# EAGLE design LTC3114 (EAGLE 6.3)
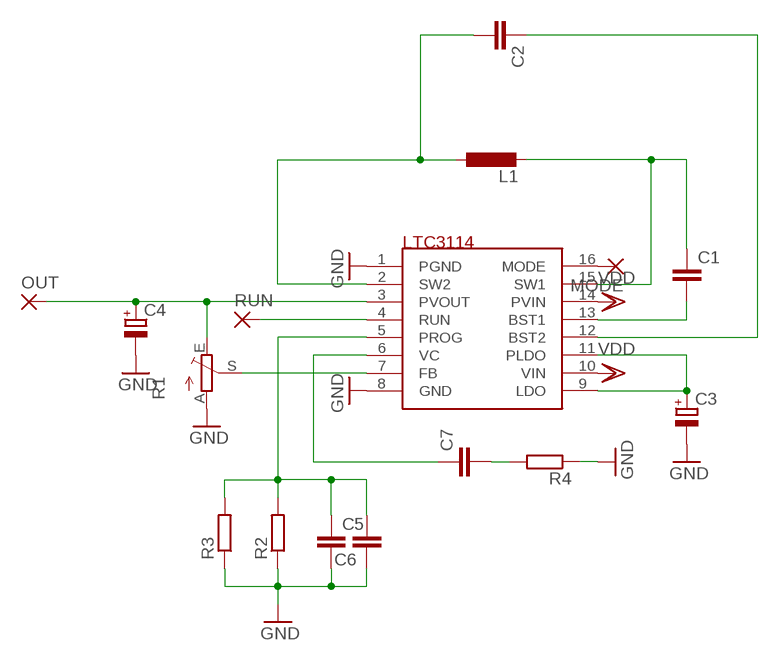
[diagram p0: schematic, sheet 1]

## Parts
C1  C-EUC0805  [C0805]
C2  C-EUC0805  [C0805]
C3  CPOL-EUE2,5-6E  [E2,5-6E]
C4  CPOL-EUE2,5-6E  [E2,5-6E]
C5  C-EUC0805  [C0805]
C6  C-EU025-025X050  [C025-025X050]
C7  C-EUC0805  [C0805]
L1  L-EUL3225M  [L3225M]
MODE  1,6/0,8  [1,6/0,8]
OUT  1,6/0,8  [1,6/0,8]
R1  TRIM_EU-RJ9W  [RJ9W]
R2  R-EU_M0805  [M0805]
R3  R-EU_0204/7  [0204/7]
R4  R-EU_M0805  [M0805]
RUN  1,6/0,8  [1,6/0,8]
U$1  LTC3114  [TSSOP16]

## Nets
GND: C3.- C4.- C5.2 C6.1 R1.A R2.1 R3.1 R4.1 U$1.1(PGND) U$1.8(GND)
N$1: C1.2 U$1.13(BST1)
N$2: C1.1 L1.2 U$1.15(SW1)
N$3: C2.1 U$1.12(BST2)
N$4: C2.2 L1.1 U$1.2(SW2)
N$5: C3.+ U$1.9(LDO) U$1.11(PLDO)
N$6: R1.S U$1.7(FB)
N$7: C4.+ OUT.1(P) R1.E U$1.3(PVOUT)
N$8: RUN.1(P) U$1.4(RUN)
N$9: C5.1 C6.2 R2.2 R3.2 U$1.5(PROG)
N$10: MODE.1(P) U$1.16(MODE)
N$13: C7.2 R4.2
N$14: C7.1 U$1.6(VC)
VDD: U$1.10(VIN) U$1.14(PVIN)

## Library data of the parts
C1 C2 C6 = resistor:C-EU: CAPACITOR, European symbol
C3 C4 = rcl:CPOL-EU: POLARIZED CAPACITOR, European symbol
C5 C7 = rcl:C-EU: CAPACITOR, European symbol
L1 = rcl:L-EU: INDUCTOR, European symbol
MODE OUT RUN = wirepad:1,6/0,8: THROUGH-HOLE PAD
R1 = pot:TRIM_EU-: POTENTIOMETER
R2-R4 = rcl:R-EU_: RESISTOR, European symbol
U$1 = ref-packages:LTC3114

## Net classes
0 default: clearance 0.7 mm

## Board
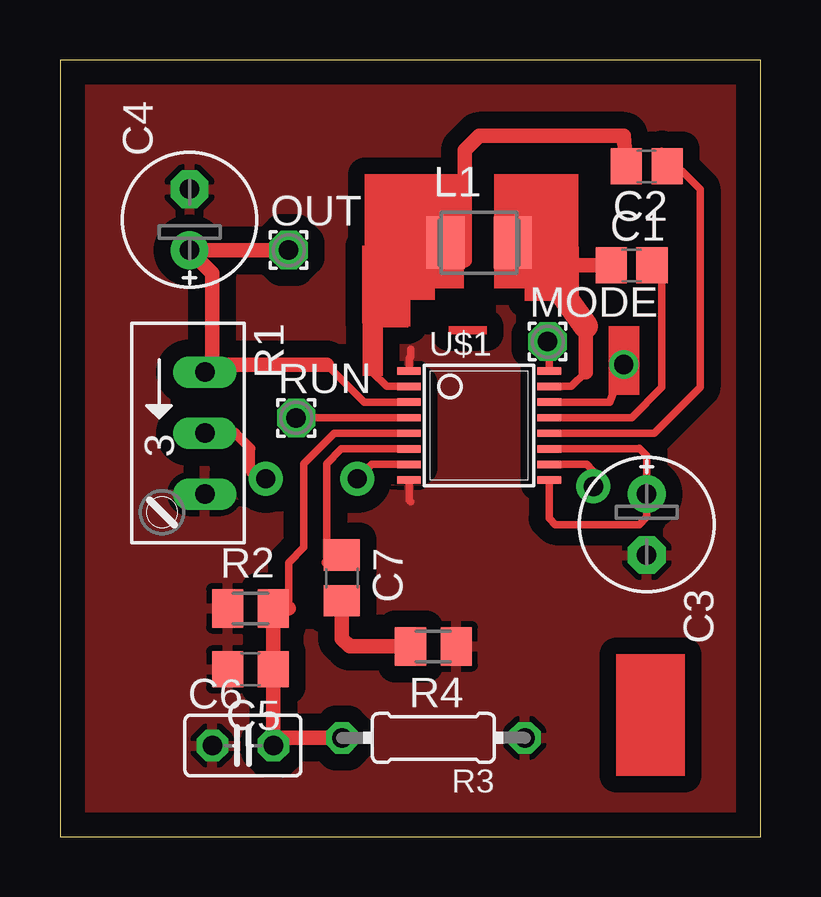
[diagram p1: board, top side]
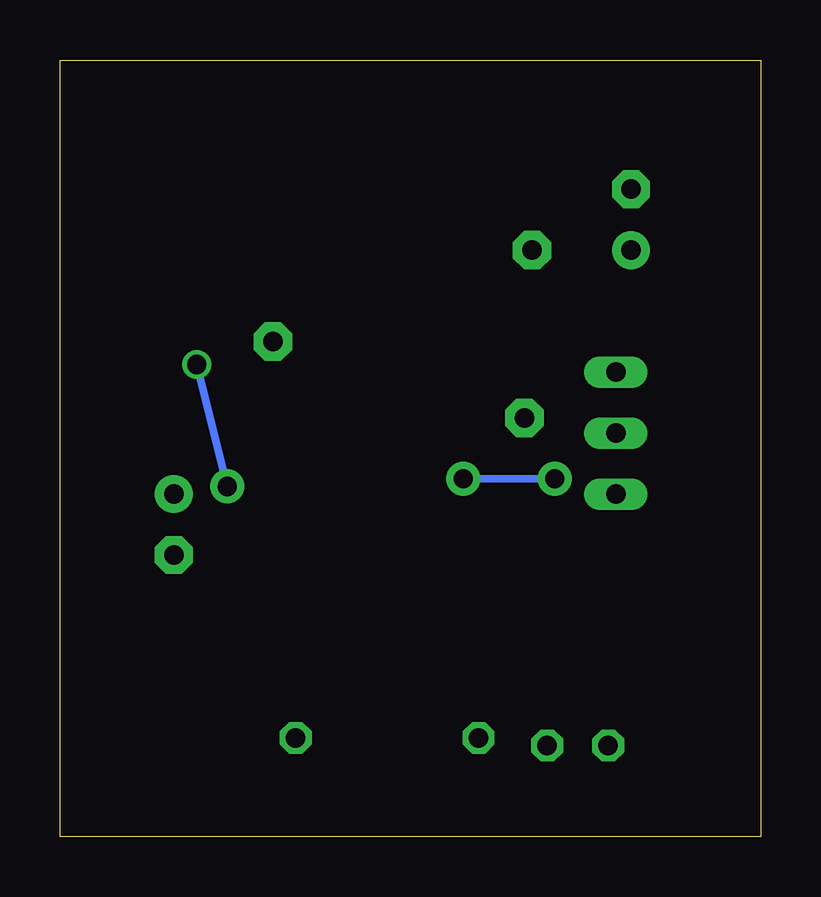
[diagram p2: board, bottom side, seen from below]

Size 29.19 x 32.37 mm. Coordinates in mm from the lower left corner, seen from the top.
Outline: 0,0 29.19,0 29.19,32.37 0,32.37 0,0
Copper layers (1*16): Top 0.035mm / dielectric 1.5mm / Bottom 0.035mm
Design rules "default": minimum track width 10mil, minimum drill 24mil, track to track 8mil, track to pad 8mil, pad to pad 8mil, via to via 8mil, smd to smd 8mil, copper to edge 40mil, drill to drill 8mil, minimum pad ring 10mil, minimum via ring 8mil, stop-mask expansion 4mil, vias tented up to drill 0mil, thermal gap 10mil

### Footprints (pad centres in the part's own frame; a part is rotated, then mirrored left to right if it is on the bottom)
C0805 = smd 1.3 x 1.5: 1 -0.85,0; 2 0.85,0
E2,5-6E = drill 0.813 pad 1.575: + -1.27,0 | drill 0.813 pad 1.575 octagon: - 1.27,0
C0805' = smd 1.3 x 1.5: 1 -0.95,0; 2 0.95,0
C025-025X050 = drill 0.813 octagon: 1 -1.27,0; 2 1.27,0
L3225M = smd 1.6 x 2.2: 1 -1.4,0; 2 1.4,0
1,6/0,8 = drill 0.813 pad 1.6 octagon: 1 0,0
RJ9W = drill 0.813 long: A 2.54,0.635; E -2.54,0.635; S 0,0.635
M0805 = smd 1.3 x 1.6: 1 -0.95,0; 2 0.95,0
0204/7 = drill 0.813 octagon: 1 -3.81,0; 2 3.81,0
TSSOP16 = smd 0.305 x 0.991: 1 -2.275,-2.918; 2 -1.625,-2.918; 3 -0.975,-2.918; 4 -0.325,-2.918; 5 0.325,-2.918; 6 0.975,-2.918; 7 1.625,-2.918; 8 2.275,-2.918; 9 2.275,2.918; 10 1.625,2.918; 11 0.975,2.918; 12 0.325,2.918; 13 -0.325,2.918; 14 -0.975,2.918; 15 -1.625,2.918; 16 -2.275,2.918

### Placement (x,y rotation side)
C1  23.81,23.81 0 top
C2  24.45,27.94 180 top
C3  24.45,13.02 270 top
C4  5.4,25.72 90 top
C5  [C0805']  7.94,6.99 180 top
C6  7.62,3.81 0 top
C7  [C0805']  11.75,10.79 270 top
L1  17.46,24.77 0 top
MODE  20.32,20.64 0 top
OUT  9.53,24.45 0 top
R1  5.4,16.83 270 top
R2  7.94,9.53 0 top
R3  15.56,4.13 180 top
R4  15.56,7.94 180 top
RUN  9.84,17.46 0 top
U$1  17.46,17.15 270 top

### Tracks (layer width: path | path; a pad name or v marks a point on that pad's centre or on a via)
GND
  Top 0.305: U$1.1 14.54,19.94 14.6,20 14.6,20.32 | U$1.8 14.54,14.03 14.6,13.97
  pour Top: -5.4,-8.25 41.59,-8.25 41.59,36.2 -5.4,36.2
N$1
  Top 0.305: U$1.13 23.82,17.47 25.08,18.73 25.08,23.39 C1.2
N$2
  Top 0.305: U$1.15 21.31,18.77 21.91,19.37 | 20.32,23.5 20,23.5 | 20,23.5 L1.2 | 20.32,23.81 20,23.5
  Top 0.61: 21.91,19.37 21.91,21.27 | C1.1 20.32,23.81
  Top 1.016: 21.91,21.27 20.32,23.5
N$3
  Top 0.305: C2.1 25.08,28.58 26.67,26.99 26.67,18.73 24.76,16.83 U$1.12
N$4
  Top 0.305: U$1.2 13.62,18.77 13.02,19.37 13.02,21.27 15.24,23.5 L1.1 16.86,24.02
  Top 0.61: C2.2 23.5,29.21 17.46,29.21 16.86,28.61 16.86,24.02
N$5
  Top 0.305: 24.15,16.17 U$1.11 24.11,16.17 24.13,16.19 24.15,16.17 | 24.15,16.17 24.45,15.88 C3.+ 24.45,13.33 24.13,13.02 20.64,13.02 20.38,13.28 U$1.9
N$6  (via drill 0.8 pad 1.42)
  Top 0.305: U$1.7 12.98,15.52 v12.38,14.92
  Top 0.406: v8.57,14.92 8.26,14.92 7.94,15.24 7.94,16.19 7.3,16.83 R1.S
  Bottom 0.305: v12.38,14.92 v8.57,14.92
N$7
  Top 0.305: U$1.3 12.68,18.12 11.11,19.69
  Top 0.61: 11.11,19.69 6.35,19.69 | 6.35,19.69 R1.E | 6.35,19.69 6.35,23.5 C4.+ OUT.1
N$8
  Top 0.305: U$1.4 RUN.1
N$9
  Top 0.305: U$1.5 11.42,16.82 10.16,15.56 10.16,12.06 9.53,11.43 9.53,9.53
  Top 0.61: 9.53,9.53 R2.2 C5.1 C6.2 9.21,4.13 R3.2
N$10
  Top 0.305: U$1.16 20.38,20.58 MODE.1
N$13
  Top 0.61: C7.2 11.75,8.26 12.06,7.94 R4.2
N$14
  Top 0.305: U$1.6 11.72,16.17 11.11,15.56 11.11,11.43
  Top 0.406: C7.1 11.43,11.74 11.11,11.43
VDD  (via drill 0.8 pad 1.2, 0.8 pad 1.42)
  Top 0.305: U$1.10 21.94,15.52 22.22,15.24 v22.22,14.61 | v23.5,19.69 22.9,18.12 20.44,18.12 U$1.14
  Bottom 0.305: v22.22,14.61 v23.5,19.69
(copper drawn outside any net)
  shapes: Top area x13